# EAGLE design shield (EAGLE 8.3.2)
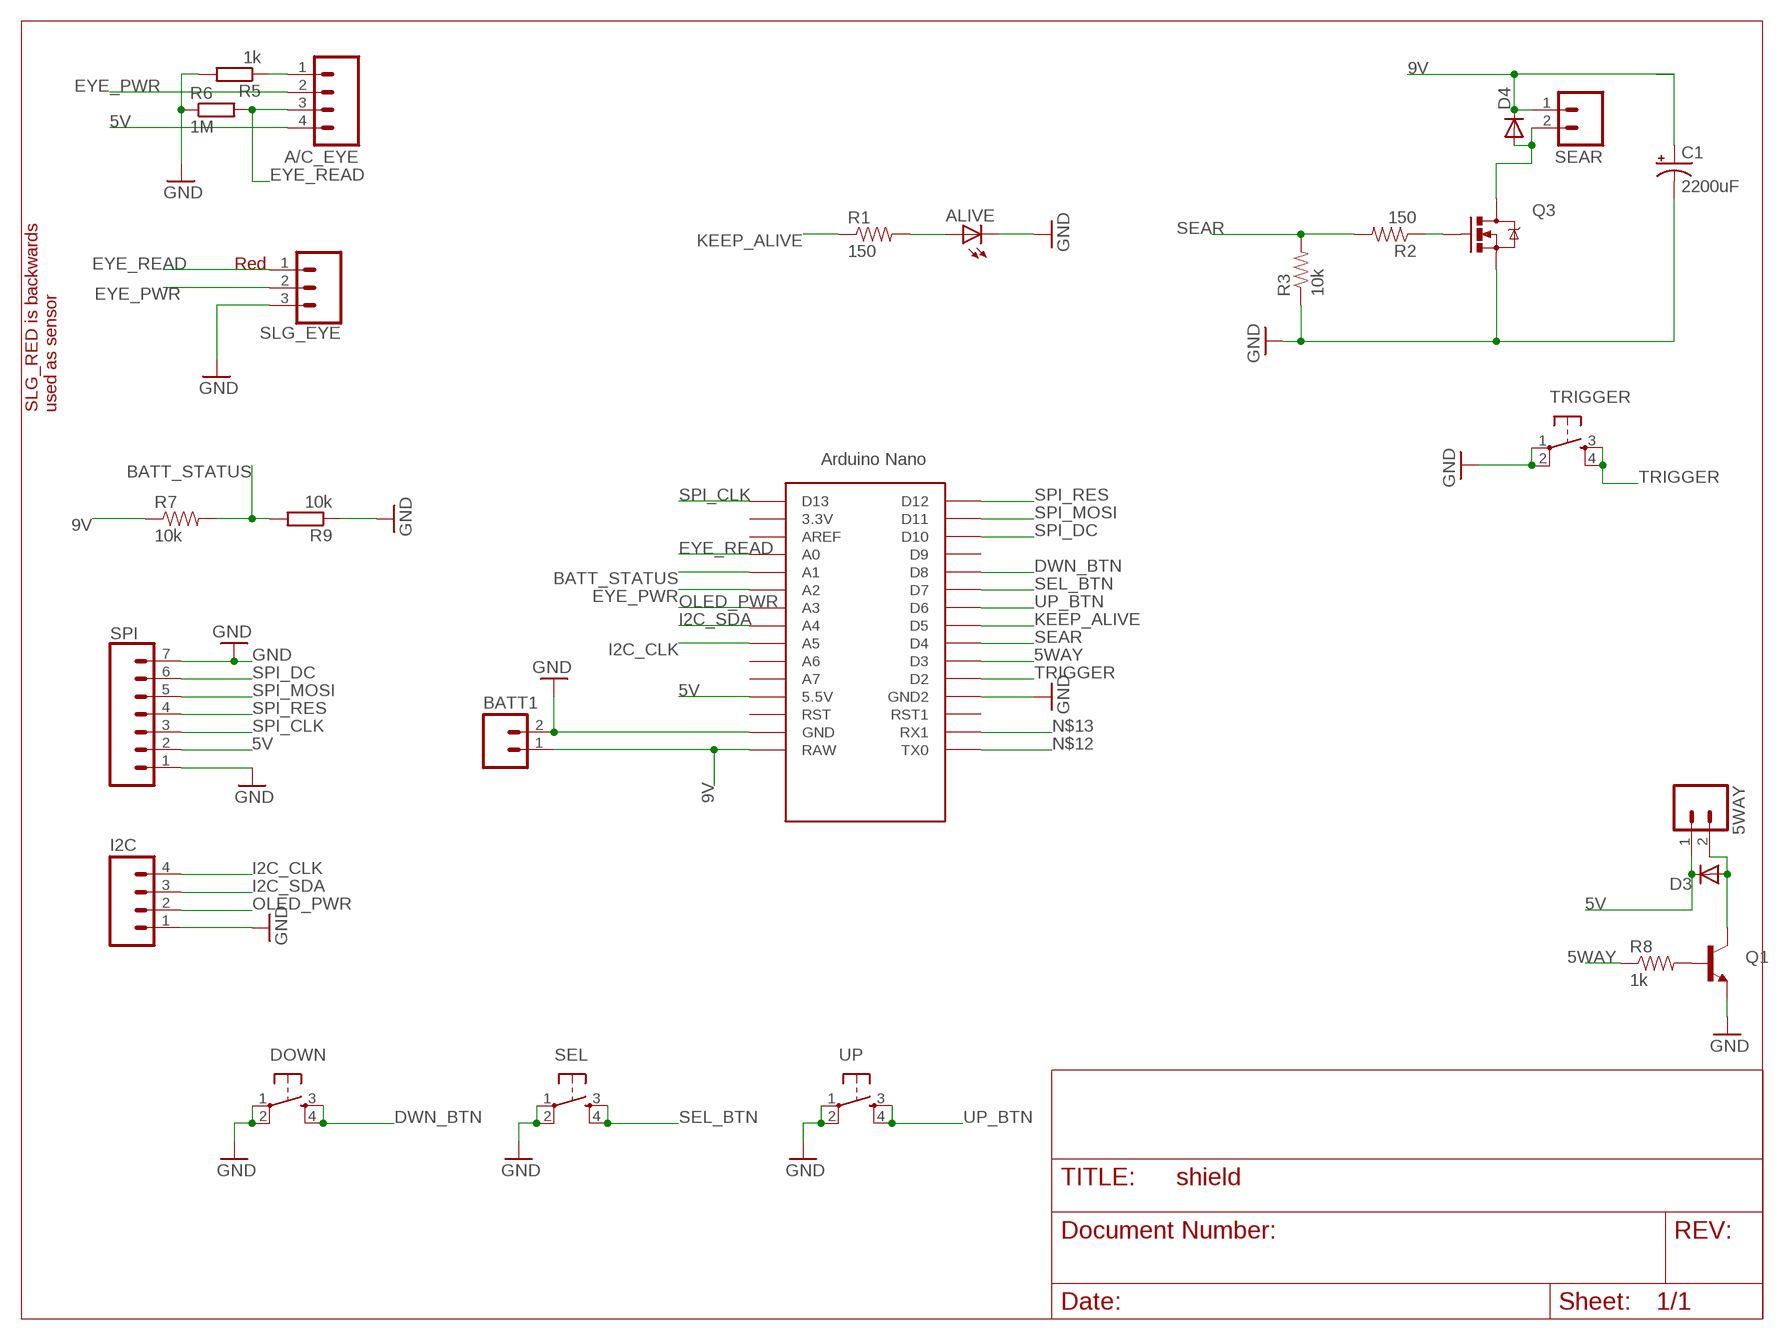
[diagram p0: schematic, sheet 1]

## Parts
5WAY  M02PTH  [1X02]
A/C_EYE  M04PTH  [1X04]
ALIVE  LED3MM  [LED3MM]
BATT1  M02PTH  [1X02]
C1  2200uF  CAP_POLPTH4  [CPOL-RADIAL-1000UF-25V]
D3  DIODEPTH  [DIODE-1N4001]
D4  DIODEPTH  [DIODE-1N4001]
DOWN  TAC_SWITCHPTH  [TACTILE-PTH]
I2C  M04PTH  [1X04]
Q1  TRANSISTOR_NPNTO-92-AMMO  [TO-92-AMMO]
Q3  MOSFET-NCHANNELPTH2  [TO220V]
R1  150  RESISTORPTH-1/4W  [AXIAL-0.4]
R2  150  RESISTORPTH-1/4W  [AXIAL-0.4]
R3  10k  RESISTORPTH-1/4W  [AXIAL-0.4]
R5  1k  R-EU_0309/V  [0309V]
R6  1M  R-EU_0309/V  [0309V]
R7  10k  RESISTORPTH-1/4W  [AXIAL-0.4]
R8  1k  RESISTORPTH-1/4W  [AXIAL-0.4]
R9  10k  R-EU_0309/V  [0309V]
SEAR  M02PTH  [1X02]
SEL  TAC_SWITCHPTH  [TACTILE-PTH]
SLG_EYE  CONN_03  [1X03]
SPI  CONN_07  [1X07]
TRIGGER  TAC_SWITCHPTH  [TACTILE-PTH]
U$5  NANO  [NANO]
UP  TAC_SWITCHPTH  [TACTILE-PTH]

## Nets
5V: 5WAY.1 A/C_EYE.4 D3.C SPI.2 U$5.5V(5.5V)
5WAY: R8.P$1 U$5.D3
9V: BATT1.1 C1.1(+) D4.C R7.P$1 SEAR.1 U$5.RAW
BATT_STATUS: R7.P$2 R9.2 U$5.A1
DWN_BTN: DOWN.3 DOWN.4 U$5.D8
EYE_GND: A/C_EYE.1 R5.1
EYE_PWR: A/C_EYE.2 SLG_EYE.2 U$5.A2
EYE_READ: A/C_EYE.3 R6.2 SLG_EYE.1 U$5.A0
GND: ALIVE.K(C) BATT1.2 C1.2(-) DOWN.1 DOWN.2 I2C.1 Q1.1(E) Q3.3(S) R3.P$1 R5.2 R6.1 R9.1 SEL.1 SEL.2 SLG_EYE.3 SPI.1 SPI.7 TRIGGER.1 TRIGGER.2 U$5.GND U$5.GND1(GND2) UP.1 UP.2
I2C_CLK: I2C.4 U$5.A5
I2C_SDA: I2C.3 U$5.A4
KEEP_ALIVE: R1.P$1 U$5.D5
N$1: Q1.2(B) R8.P$2
N$2: ALIVE.A R1.P$2
N$3: Q3.1(G) R2.P$1
N$7: D4.A Q3.2(D) SEAR.2
N$12: U$5.TX0
N$13: U$5.RX1
N$15: 5WAY.2 D3.A Q1.3(C)
OLED_PWR: I2C.2 U$5.A3
SEAR: R2.P$2 R3.P$2 U$5.D4
SEL_BTN: SEL.3 SEL.4 U$5.D7
SPI_CLK: SPI.3 U$5.D13
SPI_DC: SPI.6 U$5.D10
SPI_MOSI: SPI.5 U$5.D11
SPI_RES: SPI.4 U$5.D12
TRIGGER: TRIGGER.3 TRIGGER.4 U$5.D2
UP_BTN: U$5.D6 UP.3 UP.4
Unconnected: U$5.3.3V U$5.A6 U$5.A7 U$5.AREF U$5.D9 U$5.ICSP1 U$5.ICSP2 U$5.ICSP3 U$5.ICSP4 U$5.ICSP5 U$5.ICSP6 U$5.RST U$5.RST1

## Notes on the sheet
- Red
- SLG_RED is backwards
  used as sensor

## Library data of the parts
5WAY BATT1 SEAR = SparkFun:M02: Header 2 Standard 2-pin 0.1" header. Use with straight break away headers (SKU : PRT-00116), right angle break away headers (PRT-00553), swiss pins (PRT-00743), machine pins (PRT-00117), and female headers (PRT-00115). Molex polarized connector foot print use with SKU : PRT-08233 with associated crimp pins and housings.
A/C_EYE I2C = SparkFun:M04: Header 4 Standard 4-pin 0.1" header. Use with straight break away headers (SKU : PRT-00116), right angle break away headers (PRT-00553), swiss pins (PRT-00743), machine pins (PRT-00117), and female headers (PRT-00115). Molex polarized connector foot print use with SKU : PRT-08231 with associated crimp pins and housings. 1MM SMD Version SKU: PRT-10208
ALIVE = SparkFun:LED: LEDs Standard schematic elements and footprints for 5mm, 3mm, 1206, and 0603 sized LEDs. 5mm - Spark Fun Electronics SKU : COM-00529 (and others)
C1 = SparkFun:CAP_POL: Capacitor Polarized These are standard SMD and PTH capacitors. Normally 10uF, 47uF, and 100uF in electrolytic and tantalum varieties. Always verify the external diameter of the through hole cap, it varies with capacity, voltage, and manufacturer. The EIA devices should be standard.
D3 D4 = SparkFun:DIODE: Diode These are standard reverse protection diodes and small signal diodes. SMA package can handle up to about 1A. SOD-323 can handle about 200mA. What the SOD-323 package when ordering, there are some mfgs out there that are 5-pin packages.
DOWN SEL TRIGGER UP = SparkFun:TAC_SWITCH: Momentary Switch Button commonly used for reset or general input. Spark Fun Electronics SKU : COM-00097
Q1 = SparkFun:TRANSISTOR_NPN: Transistor NPN BJT configuration in SOT23 package. MMBT2222 is the common NPN we use. Double check BCE configuration again layout.
Q3 = SparkFun:MOSFET-NCHANNEL
R1-R3 R7 R8 = SparkFun:RESISTOR: Resistor Basic schematic elements and footprints for 0603, 1206, and PTH resistors.
R5 R6 R9 = resistor:R-EU_: RESISTOR, European symbol
SLG_EYE = SparkFun-Connectors:CONN_03: Multi connection point. Often used as Generic Header-pin footprint for 0.1 inch spaced/style header connections On any of the 0.1 inch spaced packages, you can populate with these: Break Away Headers - Straight <https://www.sparkfun.com/products/116> (PRT-00116) Break Away Male Headers - Right Angle <https://www.sparkfun.com/products/553> (PRT-00553) Female Headers <https://www.sparkfun.com/products/115> (PRT-00115) Break Away Headers - Machine Pin <https://www.sparkfun.com/products/117> (PRT-00117) Break Away Female Headers - Swiss Machine Pin <https://www.sparkfun.com/products/743> (PRT-00743) Stackable Header - 3 Pin (Female, 0.1") <https://www.sparkfun.com/products/13875> (PRT-13875) For SCREWTERMINALS and SPRING TERMINALS visit here: Screw Terimnals on SparkFun.com <https://www.sparkfun.com/search/results?term=Screw+Terminals> (5mm/3.5mm/2.54mm spacing) This device is also useful as a general connection point to wire up your design to another part of your project. Our various solder wires solder well into these plated through hole pads. Hook-Up Wire - Assortment (Stranded, 22 AWG) <https://www.sparkfun.com/products/11375> (PRT-11375) Hook-Up Wire - Assortment (Solid Core, 22 AWG) <https://www.sparkfun.com/products/11367> (PRT-11367) View the entire wire category on our website here <https://www.sparkfun.com/categories/141> Special notes: Molex polarized connector foot print use with SKU : PRT-08232 with associated crimp pins and housings.
SPI = SparkFun-Connectors:CONN_07: Multi connection point. Often used as Generic Header-pin footprint for 0.1 inch spaced/style header connections On any of the 0.1 inch spaced packages, you can populate with these: Break Away Headers - Straight <https://www.sparkfun.com/products/116> (PRT-00116) Break Away Male Headers - Right Angle <https://www.sparkfun.com/products/553> (PRT-00553) Female Headers <https://www.sparkfun.com/products/115> (PRT-00115) Break Away Headers - Machine Pin <https://www.sparkfun.com/products/117> (PRT-00117) Break Away Female Headers - Swiss Machine Pin <https://www.sparkfun.com/products/743> (PRT-00743) For SCREWTERMINALS and SPRING TERMINALS visit here: Screw Terimnals on SparkFun.com <https://www.sparkfun.com/search/results?term=Screw+Terminals> (5mm/3.5mm/2.54mm spacing) This device is also useful as a general connection point to wire up your design to another part of your project. Our various solder wires solder well into these plated through hole pads. Hook-Up Wire - Assortment (Stranded, 22 AWG) <https://www.sparkfun.com/products/11375> (PRT-11375) Hook-Up Wire - Assortment (Solid Core, 22 AWG) <https://www.sparkfun.com/products/11367> (PRT-11367) View the entire wire category on our website here <https://www.sparkfun.com/categories/141> Special notes: Molex polarized connector foot print use with SKU : PRT-08231 with associated crimp pins and housings. 1MM SMD Version SKU: PRT-10208 NOTES ON THE VARIANTS LOCK and LOCK_LONGPADS... This footprint was designed to help hold the alignment of a through-hole component (i.e. 6-pin header) while soldering it into place. You may notice that each hole has been shifted either up or down by 0.005 of an inch from it's more standard position (which is a perfectly straight line). This slight alteration caused the pins (the squares in the middle) to touch the edges of the holes. Because they are alternating, it causes a "brace" to hold the component in place. 0.005 has proven to be the perfect amount of "off-center" position when using our standard breakaway headers. Although looks a little odd when you look at the bare footprint, once you have a header in there, the alteration is very hard to notice. Also,if you push a header all the way into place, it is covered up entirely on the bottom side.
U$5 = Arduino-clone:NANO: Arduino Nano

## Board
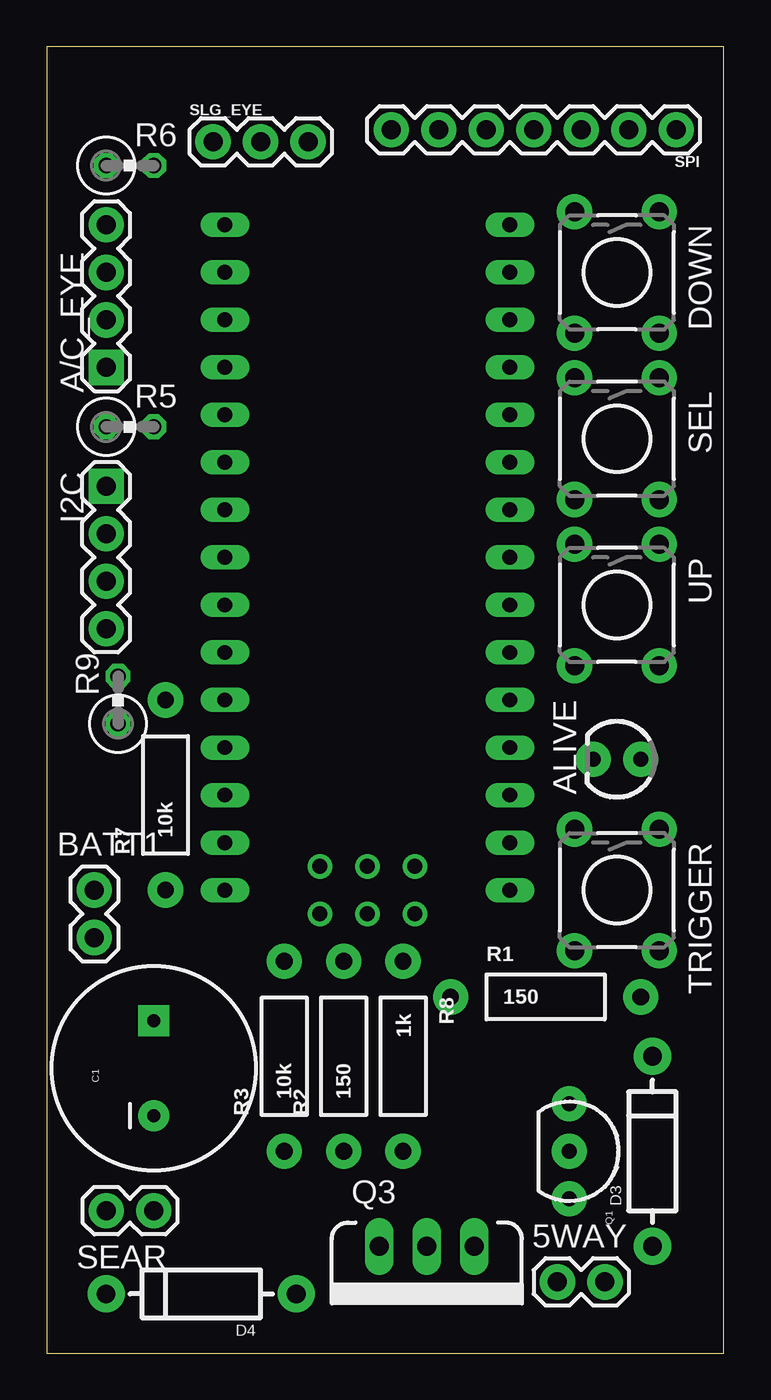
[diagram p1: board, top side]
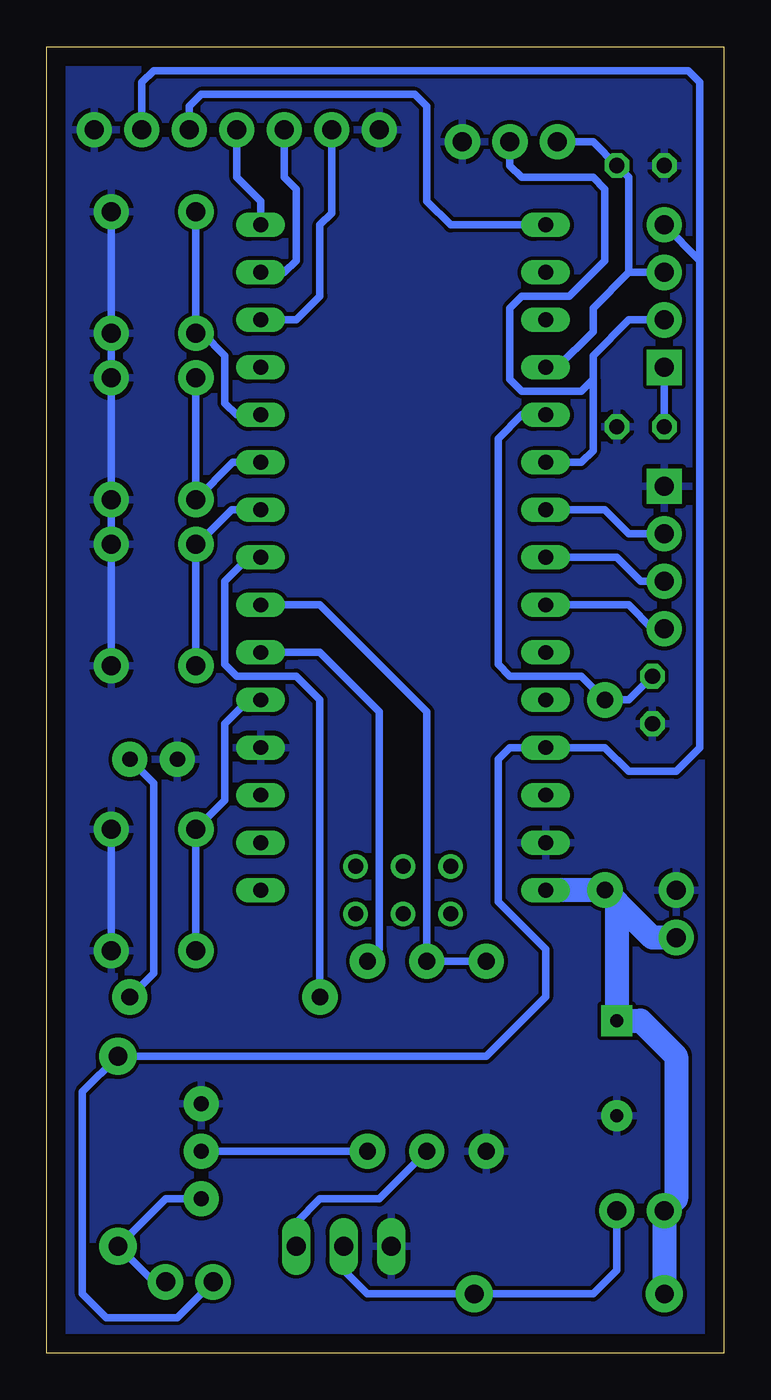
[diagram p2: board, bottom side, seen from below]

Size 36.2 x 69.85 mm. Coordinates in mm from the lower left corner, seen from the top.
Outline: 0,0 36.2,0 36.2,69.85 0,69.85 0,0
Copper layers (1*16): Top 0.035mm / dielectric 1.5mm / Bottom 0.035mm
Design rules "default": minimum track width 10mil, minimum drill 24mil, track to track 8mil, track to pad 8mil, pad to pad 8mil, via to via 8mil, smd to smd 8mil, copper to edge 40mil, drill to drill 8mil, minimum pad ring 10mil, minimum via ring 8mil, stop-mask expansion 4mil, vias tented up to drill 0mil, thermal gap 10mil

### Footprints (pad centres in the part's own frame; a part is rotated, then mirrored left to right if it is on the bottom)
1X02 = drill 1.016 pad 1.88: 1 0,0; 2 2.54,0
1X04 = drill 1.016 pad 1.88 square: 1 0,0 | drill 1.016 pad 1.88: 2 2.54,0; 3 5.08,0; 4 7.62,0
LED3MM = drill 0.813 pad 1.88: A -1.27,0; K 1.27,0
CPOL-RADIAL-1000UF-25V = drill 0.7 pad 1.651 square: 1 2.54,0 | drill 0.7 pad 1.651: 2 -2.54,0
DIODE-1N4001 = drill 1 pad 1.981: A -5.08,0; C 5.08,0
TACTILE-PTH = drill 1.016 pad 1.88: 1 -3.251,2.261; 2 3.251,2.261; 3 -3.251,-2.261; 4 3.251,-2.261
TO-92-AMMO = drill 0.813 pad 1.88: 1 -2.54,0; 2 0,0; 3 2.54,0
TO220V = drill 1.016 long: 1 -2.54,0; 2 0,0; 3 2.54,0
AXIAL-0.4 = drill 0.9 pad 1.88: P$1 -5.08,0; P$2 5.08,0
0309V = drill 0.813 octagon: 1 -1.27,0; 2 1.27,0
1X03 = drill 1.016 pad 1.88: 1 0,0; 2 2.54,0; 3 5.08,0
1X07 = drill 1.016 pad 1.88: 1 0,0; 2 2.54,0; 3 5.08,0; 4 7.62,0; 5 10.16,0; 6 12.7,0; 7 15.24,0
NANO = drill 0.8 long: 3.3V -10.16,24.13; 5V -10.16,-1.27; A0 -10.16,19.05; A1 -10.16,16.51; A2 -10.16,13.97; A3 -10.16,11.43; A4 -10.16,8.89; A5 -10.16,6.35; A6 -10.16,3.81; A7 -10.16,1.27; AREF -10.16,21.59; D2 5.08,1.27; D3 5.08,3.81; D4 5.08,6.35; D5 5.08,8.89; D6 5.08,11.43; D7 5.08,13.97; D8 5.08,16.51; D9 5.08,19.05; D10 5.08,21.59; D11 5.08,24.13; D12 5.08,26.67; D13 -10.16,26.67; GND -10.16,-6.35; GND1 5.08,-1.27; RAW -10.16,-8.89; RST -10.16,-3.81; RST1 5.08,-3.81; RX1 5.08,-6.35; TX0 5.08,-8.89 | drill 0.8: ICSP1 -5.08,-10.16; ICSP2 -5.08,-7.62; ICSP3 -2.54,-10.16; ICSP4 -2.54,-7.62; ICSP5 0,-10.16; ICSP6 0,-7.62

### Placement (x,y rotation side)
5WAY  27.3,3.81 0 top
A/C_EYE  3.17,52.7 90 top
ALIVE  30.48,31.75 180 top
BATT1  2.54,22.23 90 top
C1  5.71,15.24 90 top
D3  32.38,10.79 90 top
D4  8.26,3.17 180 top
DOWN  30.48,57.78 270 top
I2C  3.17,46.35 270 top
Q1  27.94,10.79 270 top
Q3  20.32,5.71 180 top
R1  26.67,19.05 0 top
R2  15.88,15.88 90 top
R3  12.7,15.88 90 top
R5  4.45,49.53 0 top
R6  4.45,63.5 0 top
R7  6.35,29.84 90 top
R8  19.05,15.88 270 top
R9  3.81,34.92 90 top
SEAR  3.17,7.62 0 top
SEL  30.48,48.9 270 top
SLG_EYE  8.89,64.77 0 top
SPI  33.66,65.41 180 top
TRIGGER  30.48,24.77 270 top
U$5  19.68,33.66 0 top
UP  30.48,40.01 270 top

### Tracks (layer width: path | path; a pad name or v marks a point on that pad's centre or on a via)
5V
  Bottom 0.406: 1.27,58.42 1.27,67.94 1.91,68.58 30.48,68.58 31.11,67.94 SPI.2 | A/C_EYE.4 1.27,58.42 | 1.27,58.42 1.27,32.38 2.54,31.11 5.08,31.11 6.35,32.38 U$5.5V 11.43,32.38 12.06,31.75 12.06,24.13 9.53,21.59 9.53,19.05 12.7,15.88 D3.C 34.29,13.97 34.29,3.17 33.02,1.91 29.21,1.91 5WAY.1
5WAY
  Bottom 0.406: U$5.D3 23.5,37.47 22.86,37.47 21.59,37.47 18.41,34.29 18.41,21.59 R8.P$1
9V
  Bottom 1.27: D4.C SEAR.1 2.54,8.26 2.54,15.88 4.45,17.78 C1.1 5.71,24.13 R7.P$1 | R7.P$1 U$5.RAW | BATT1.1 3.81,22.23 R7.P$1
BATT_STATUS
  Bottom 0.406: R9.2 5.08,34.92 R7.P$2 7.62,36.2 11.43,36.2 12.06,36.83 12.06,48.9 10.79,50.16 U$5.A1
DWN_BTN
  Bottom 0.406: DOWN.3 DOWN.4 27.86,54.53 26.67,53.34 26.67,50.8 26.04,50.16 U$5.D8
EYE_GND
  Bottom 0.406: A/C_EYE.1 R5.1
EYE_PWR
  Bottom 0.406: U$5.A2 7.62,47.62 6.99,48.26 6.99,52.07 | 6.99,52.07 6.99,53.34 5.08,55.24 A/C_EYE.2 | 6.99,52.07 7.62,51.44 10.79,51.44 11.43,52.07 11.43,55.88 10.79,56.52 8.26,56.52 6.35,58.42 6.35,62.23 6.99,62.87 10.79,62.87 11.43,63.5 SLG_EYE.2
EYE_READ
  Bottom 0.406: U$5.A0 8.89,52.7 6.99,54.61 6.99,55.88 5.08,57.78 | 5.08,57.78 A/C_EYE.3 | 5.08,57.78 5.08,62.87 R6.2 6.99,64.77 SLG_EYE.1
GND
  Bottom 0.406: DOWN.1 DOWN.2 SEL.1 SEL.2 UP.1 UP.2 | TRIGGER.2 TRIGGER.1
  pour Bottom: 0,69.85 0,0 36.2,0 36.2,69.85
I2C_CLK
  Bottom 0.406: I2C.4 3.81,38.73 5.08,40.01 U$5.A5
I2C_SDA
  Bottom 0.406: I2C.3 4.45,41.27 5.71,42.55 U$5.A4
KEEP_ALIVE
  Bottom 0.406: U$5.D5 25.4,42.55 26.67,41.27 26.67,36.83 26.04,36.2 22.86,36.2 21.59,34.92 R1.P$1
N$1
  Bottom 0.406: R8.P$2 Q1.2
N$2
  Bottom 0.406: ALIVE.A 30.48,30.48 30.48,20.32 R1.P$2
N$3
  Bottom 0.406: R2.P$1 18.41,8.26 21.59,8.26 22.86,6.99 Q3.1
N$7
  Bottom 0.406: SEAR.2 5.71,4.45 6.99,3.17 D4.A 19.05,3.17 20.32,4.45 Q3.2
N$15
  Bottom 0.406: Q1.3 29.84,8.26 D3.A 30.48,3.81 5WAY.2
OLED_PWR
  Bottom 0.406: I2C.2 5.08,43.81 6.35,45.09 U$5.A3
SEAR
  Bottom 0.406: U$5.D4 21.59,40.01 15.88,34.29 R2.P$2 R3.P$2
SEL_BTN
  Bottom 0.406: SEL.3 SEL.4 26.24,47.62 U$5.D7
SPI_CLK
  Bottom 0.406: 8.89,60.33 U$5.D13 14.61,60.33 15.88,61.59 15.88,66.67 16.51,67.31 27.94,67.31 28.57,66.67 SPI.3
SPI_DC
  Bottom 0.406: U$5.D10 22.86,55.24 21.59,56.52 21.59,60.33 20.95,60.96 SPI.6
SPI_MOSI
  Bottom 0.406: U$5.D11 23.5,57.78 22.86,58.42 22.86,62.23 23.5,62.87 SPI.5
SPI_RES
  Bottom 0.406: U$5.D12 24.77,61.59 26.04,62.87 SPI.4
TRIGGER
  Bottom 0.406: U$5.D2 25.4,34.92 26.67,33.66 26.67,29.57 TRIGGER.3 TRIGGER.4
UP_BTN
  Bottom 0.406: 28.22,43.18 UP.4 | 28.22,43.18 UP.3 | U$5.D6 26.31,45.09 28.22,43.18